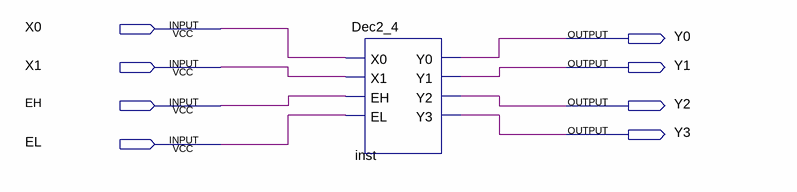
[diagram p0: schematic sheet]
// Quartus schematic DecoderDemo.bdf as structural Verilog: 1 symbols, 8 pins
module DecoderDemo (
  input  X0,
  input  X1,
  input  EH,
  input  EL,
  output Y0,
  output Y1,
  output Y2,
  output Y3
);

  Dec2_4 inst (.X0(X0), .X1(X1), .EH(EH), .EL(EL), .Y0(Y0), .Y1(Y1), .Y2(Y2), .Y3(Y3));
endmodule
